# Altium schematic sheet Sheet2.SchDoc
size 420 x 297 mm
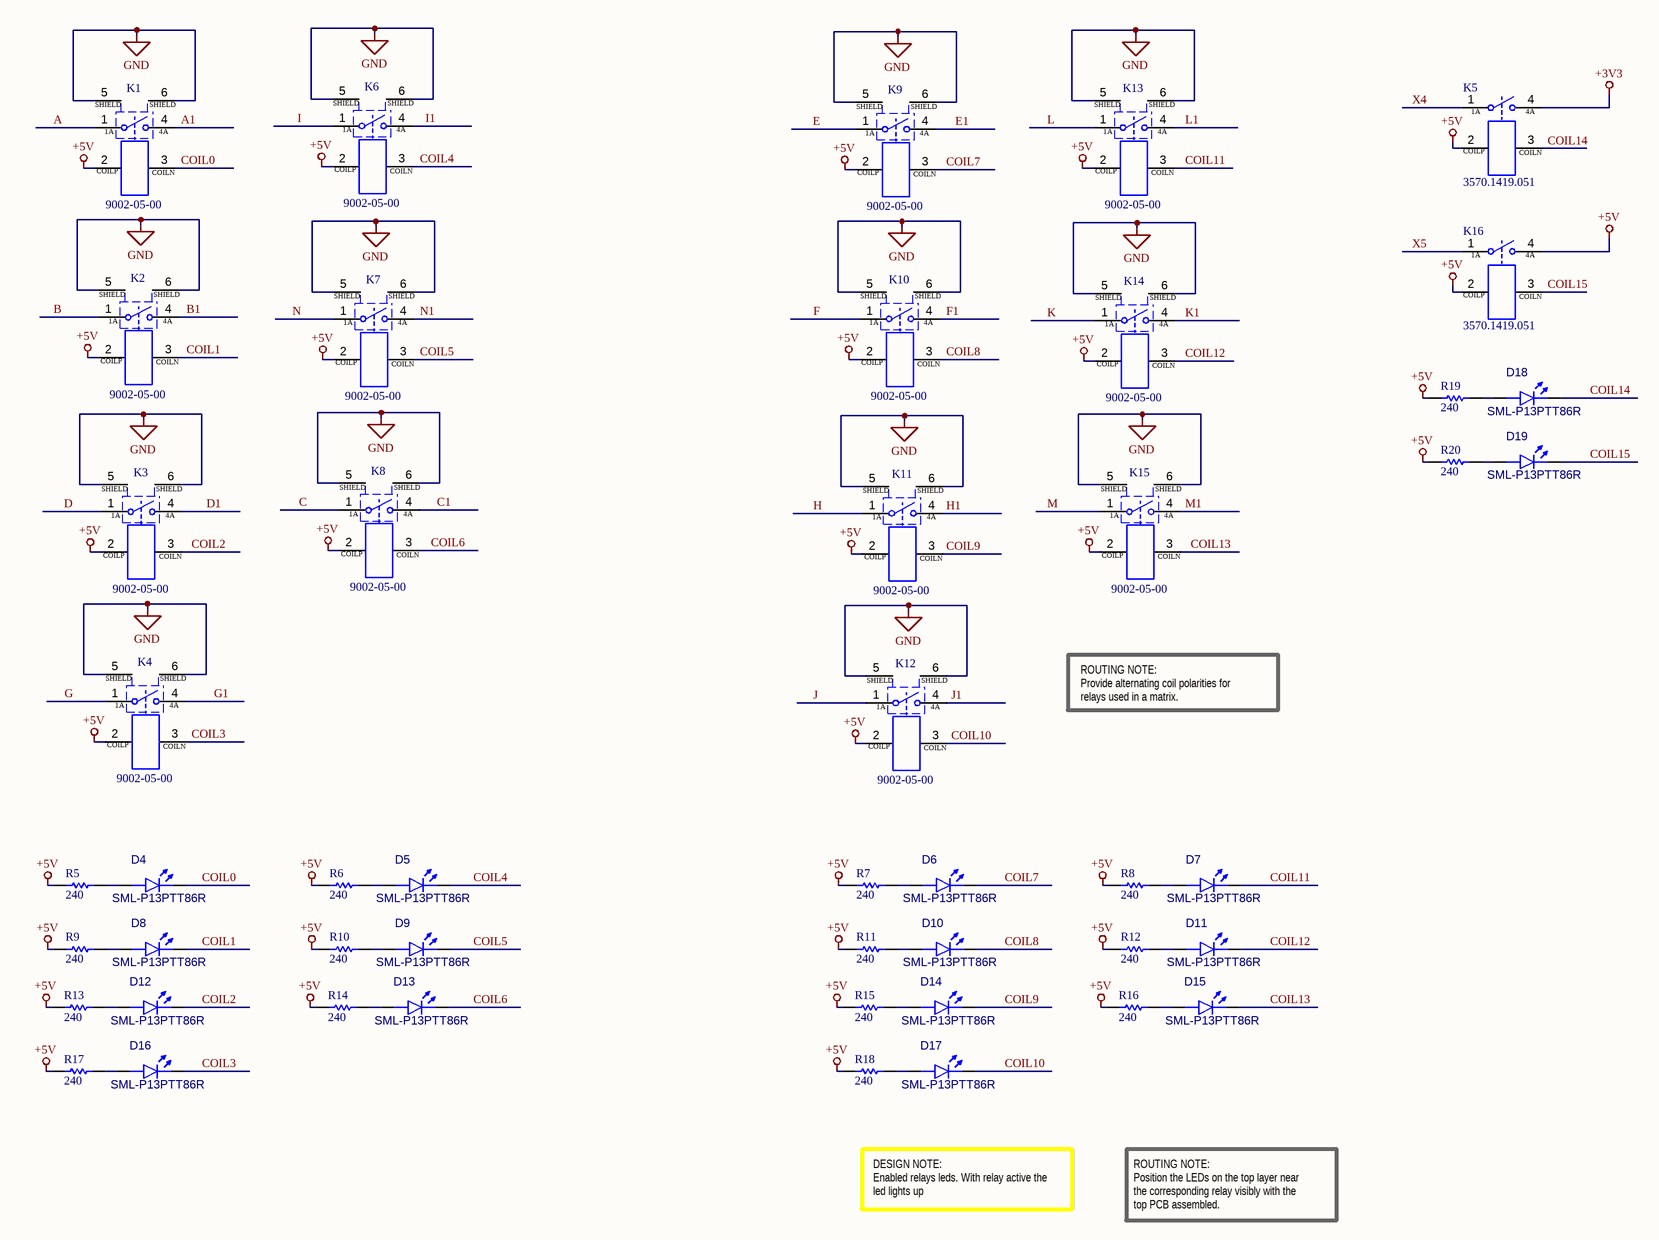
[diagram p0: Sheet2.SchDoc]

## Parts
D4  SML-P13PTT86R  [DIOC1005X02R]
D5  SML-P13PTT86R  [DIOC1005X02R]
D6  SML-P13PTT86R  [DIOC1005X02R]
D7  SML-P13PTT86R  [DIOC1005X02R]
D8  SML-P13PTT86R  [DIOC1005X02R]
D9  SML-P13PTT86R  [DIOC1005X02R]
D10  SML-P13PTT86R  [DIOC1005X02R]
D11  SML-P13PTT86R  [DIOC1005X02R]
D12  SML-P13PTT86R  [DIOC1005X02R]
D13  SML-P13PTT86R  [DIOC1005X02R]
D14  SML-P13PTT86R  [DIOC1005X02R]
D15  SML-P13PTT86R  [DIOC1005X02R]
D16  SML-P13PTT86R  [DIOC1005X02R]
D17  SML-P13PTT86R  [DIOC1005X02R]
D18  SML-P13PTT86R  [DIOC1005X02R]
D19  SML-P13PTT86R  [DIOC1005X02R]
K1  9002-05-00  [SIP564W40P254L1980H810Q6 - Cloned]
K2  9002-05-00  [SIP564W40P254L1980H810Q6 - Cloned]
K3  9002-05-00  [SIP564W40P254L1980H810Q6 - Cloned]
K4  9002-05-00  [SIP564W40P254L1980H810Q6 - Cloned]
K5  3570.1419.051  [3570.1419]
K6  9002-05-00  [SIP564W40P254L1980H810Q6 - Cloned]
K7  9002-05-00  [SIP564W40P254L1980H810Q6 - Cloned]
K8  9002-05-00  [SIP564W40P254L1980H810Q6 - Cloned]
K9  9002-05-00  [SIP564W40P254L1980H810Q6 - Cloned]
K10  9002-05-00  [SIP564W40P254L1980H810Q6 - Cloned]
K11  9002-05-00  [SIP564W40P254L1980H810Q6 - Cloned]
K12  9002-05-00  [SIP564W40P254L1980H810Q6 - Cloned]
K13  9002-05-00  [SIP564W40P254L1980H810Q6 - Cloned]
K14  9002-05-00  [SIP564W40P254L1980H810Q6 - Cloned]
K15  9002-05-00  [SIP564W40P254L1980H810Q6 - Cloned]
K16  3570.1419.051  [3570.1419]
R5  value 240  [RESC1005X04M]  (hidden comment: AC0402FR-07240RL)
R6  value 240  [RESC1005X04M]  (hidden comment: AC0402FR-07240RL)
R7  value 240  [RESC1005X04M]  (hidden comment: AC0402FR-07240RL)
R8  value 240  [RESC1005X04M]  (hidden comment: AC0402FR-07240RL)
R9  value 240  [RESC1005X04M]  (hidden comment: AC0402FR-07240RL)
R10  value 240  [RESC1005X04M]  (hidden comment: AC0402FR-07240RL)
R11  value 240  [RESC1005X04M]  (hidden comment: AC0402FR-07240RL)
R12  value 240  [RESC1005X04M]  (hidden comment: AC0402FR-07240RL)
R13  value 240  [RESC1005X04M]  (hidden comment: AC0402FR-07240RL)
R14  value 240  [RESC1005X04M]  (hidden comment: AC0402FR-07240RL)
R15  value 240  [RESC1005X04M]  (hidden comment: AC0402FR-07240RL)
R16  value 240  [RESC1005X04M]  (hidden comment: AC0402FR-07240RL)
R17  value 240  [RESC1005X04M]  (hidden comment: AC0402FR-07240RL)
R18  value 240  [RESC1005X04M]  (hidden comment: AC0402FR-07240RL)
R19  value 240  [RESC1005X04M]  (hidden comment: AC0402FR-07240RL)
R20  value 240  [RESC1005X04M]  (hidden comment: AC0402FR-07240RL)

## Nets
+3V3: K5.4(4A)
+5V: K1.2(COILP) K2.2(COILP) K3.2(COILP) K4.2(COILP) K5.2(COILP) K6.2(COILP) K7.2(COILP) K8.2(COILP) K9.2(COILP) K10.2(COILP) K11.2(COILP) K12.2(COILP) K13.2(COILP) K14.2(COILP) K15.2(COILP) K16.2(COILP) K16.4(4A) R5.1 R6.1 R7.1 R8.1 R9.1 R10.1 R11.1 R12.1 R13.1 R14.1 R15.1 R16.1 R17.1 R18.1 R19.1 R20.1
GND: K1.5(Shield) K1.6(Shield) K2.5(Shield) K2.6(Shield) K3.5(Shield) K3.6(Shield) K4.5(Shield) K4.6(Shield) K6.5(Shield) K6.6(Shield) K7.5(Shield) K7.6(Shield) K8.5(Shield) K8.6(Shield) K9.5(Shield) K9.6(Shield) K10.5(Shield) K10.6(Shield) K11.5(Shield) K11.6(Shield) K12.5(Shield) K12.6(Shield) K13.5(Shield) K13.6(Shield) K14.5(Shield) K14.6(Shield) K15.5(Shield) K15.6(Shield)
A: K1.1(1A)
A1: K1.4(4A)
B: K2.1(1A)
B1: K2.4(4A)
C: K8.1(1A)
C1: K8.4(4A)
COIL0: D4.1(K) K1.3(COILN)
COIL1: D8.1(K) K2.3(COILN)
COIL2: D12.1(K) K3.3(COILN)
COIL3: D16.1(K) K4.3(COILN)
COIL4: D5.1(K) K6.3(COILN)
COIL5: D9.1(K) K7.3(COILN)
COIL6: D13.1(K) K8.3(COILN)
COIL7: D6.1(K) K9.3(COILN)
COIL8: D10.1(K) K10.3(COILN)
COIL9: D14.1(K) K11.3(COILN)
COIL10: D17.1(K) K12.3(COILN)
COIL11: D7.1(K) K13.3(COILN)
COIL12: D11.1(K) K14.3(COILN)
COIL13: D15.1(K) K15.3(COILN)
COIL14: D18.1(K) K5.3(COILN)
COIL15: D19.1(K) K16.3(COILN)
D: K3.1(1A)
D1: K3.4(4A)
E: K9.1(1A)
E1: K9.4(4A)
F: K10.1(1A)
F1: K10.4(4A)
G: K4.1(1A)
G1: K4.4(4A)
H: K11.1(1A)
H1: K11.4(4A)
I: K6.1(1A)
I1: K6.4(4A)
J: K12.1(1A)
J1: K12.4(4A)
K: K14.1(1A)
K1: K14.4(4A)
L: K13.1(1A)
L1: K13.4(4A)
M: K15.1(1A)
M1: K15.4(4A)
N: K7.1(1A)
N1: K7.4(4A)
X4: K5.1(1A)
X5: K16.1(1A)
NetD4_2: D4.2(A) R5.2
NetD5_2: D5.2(A) R6.2
NetD6_2: D6.2(A) R7.2
NetD7_2: D7.2(A) R8.2
NetD8_2: D8.2(A) R9.2
NetD9_2: D9.2(A) R10.2
NetD10_2: D10.2(A) R11.2
NetD11_2: D11.2(A) R12.2
NetD12_2: D12.2(A) R13.2
NetD13_2: D13.2(A) R14.2
NetD14_2: D14.2(A) R15.2
NetD15_2: D15.2(A) R16.2
NetD16_2: D16.2(A) R17.2
NetD17_2: D17.2(A) R18.2
NetD18_2: D18.2(A) R19.2
NetD19_2: D19.2(A) R20.2

## Notes on the sheet
- ROUTING NOTE:
  Provide alternating coil polarities for relays used in a matrix.
- DESIGN NOTE:
  Enabled relays leds. With relay active the led lights up
- ROUTING NOTE:
  Position the LEDs on the top layer near the corresponding relay visibly with the top PCB assembled.
- 8
- 7
- 6
- 5
- 4
- 3
- DWG. NO.
- REV.
- SHT.
- REVISION
- 2
- DESCRIPTION
- DATE
- 1
- APPROVED
- THIS DOCUMENT AND THE DATA DISCLOSED HEREIN OR HEREWITH IS THE PROPERTY OF IONOSENS AND MAY BE FREELY DISTRIBUTED IN WHOLE. ALL RIGHTS ARE RESERVED.
- F
- E
- D
- C
- B
- A
- SCALE:
- A3
- SIZE
- CAGE CODE
- DWG NO.
- SHEET
- OF
- REV
- (in symbol K01-0008-01-00002-6) SHIELD

## Library data of the parts
D4-D19 = D01-0402-01-00000-1: Led green 0402; Manufacturer: ROHM; Forward Voltage: 2.1V; Max Power Dissipation: 52mW; Forward Current: 20 mA; Number of LEDs: 1; Dominant Wavelength: 560 nm; Luminous Intensity: 10 mcd; Lens Style: Rectangular, Square; Min Operating Temperature: -40°C; Mounting Technology: SMD; Colour: Green; Manufacturer P/N: SML-P13PTT86R; Max Operating Temperature: 85°C; Pins: 2; RoHS Compliant: Yes; Case/Package: 0402
K1-K4 K6-K15 = K01-0008-01-00002-6: Reed Relay 5VDC 350Ohm 0.5A SPST-NO THT; Manufacturer: COTO; Rise time: 350µs; Coil Current: 14.28mA; Release Time: 100µs; Number of Terminal: 6; Contact Form: SPST; Insulation Resistance: 1T; Coil Type: Non-Latching; Coil Voltage (DC): 5V; Contact Current Rating: 500mA; Contact Resistence: 0.2; Switching Voltage: 200V; Coil resitence: 350; Relay Type: RF; Mounting Technology: Through Hole; Case/Package: SIP; Contact Material: Ruthenium; Packaging: Bulk; Width: 19.3mm; Height: 7.6mm; Max Operating Temperature: 85°C; RoHS: Yes; Min Operating Temperature: -20°C; Pins: 6; Switching Current: 500mA; Operate Time: 350µs; Manufacturer P/N: 9002-05-00
K5 K16 = K01-0008-01-00008-1: Reed Relay, Mini SIP, 5 VDC; 1 Form A, 15W, 200 VDC, 1.25A; Manufacturer: Comus; Number of Terminal: 4; Contact Current Rating: 1A; Coil Current: 10mA; Switching Voltage: 200V; Rise time: 0s; Contact Resistence: 0.15; Coil resitence: 500; Operate Time: 350µs; Coil Voltage (DC): 5V; Insulation Resistance: 0; Release Time: 100µs; Manufacturer P/N: 3570.1419.051; Mounting Technology: TH; Contact Material: -; Relay Type: Reed; Width: 15.24mm; Contact Form: 1A; Packaging: SIP; Switching Current: 1A; Pins: 4; Case/Package: SIP; Coil Type: -; Min Operating Temperature: -40°C; RoHS: Yes; Height: 6.98mm; Max Operating Temperature: 85°C
R5-R20 = R01-0402-01-00437-2: RES SMD 240 OHM 1% 1/16W 0402; Manufacturer: Yageo; Temperature Coefficient: 100 ppm/ºC; Power Rating: 62.5mW; Voltage Rating: 50V; Packaging: Tape & Reel; Manufacturer P/N: AC0402FR-07240RL; Height: 370µm; Case/Package: 0402; Composition: Thick Film; Max Operating Temperature: 155°C; Number of Terminations: 2; RoHS: Yes; Min Operating Temperature: -55°C; Tolerance: 1%; Width: 508µm; Length: 990.6µm; Features: Automotive AEC-Q200, Moisture Resistant